# Altium schematic sheet CAN.SchDoc
size A4; SheetNumber: 3; SheetTotal: 7
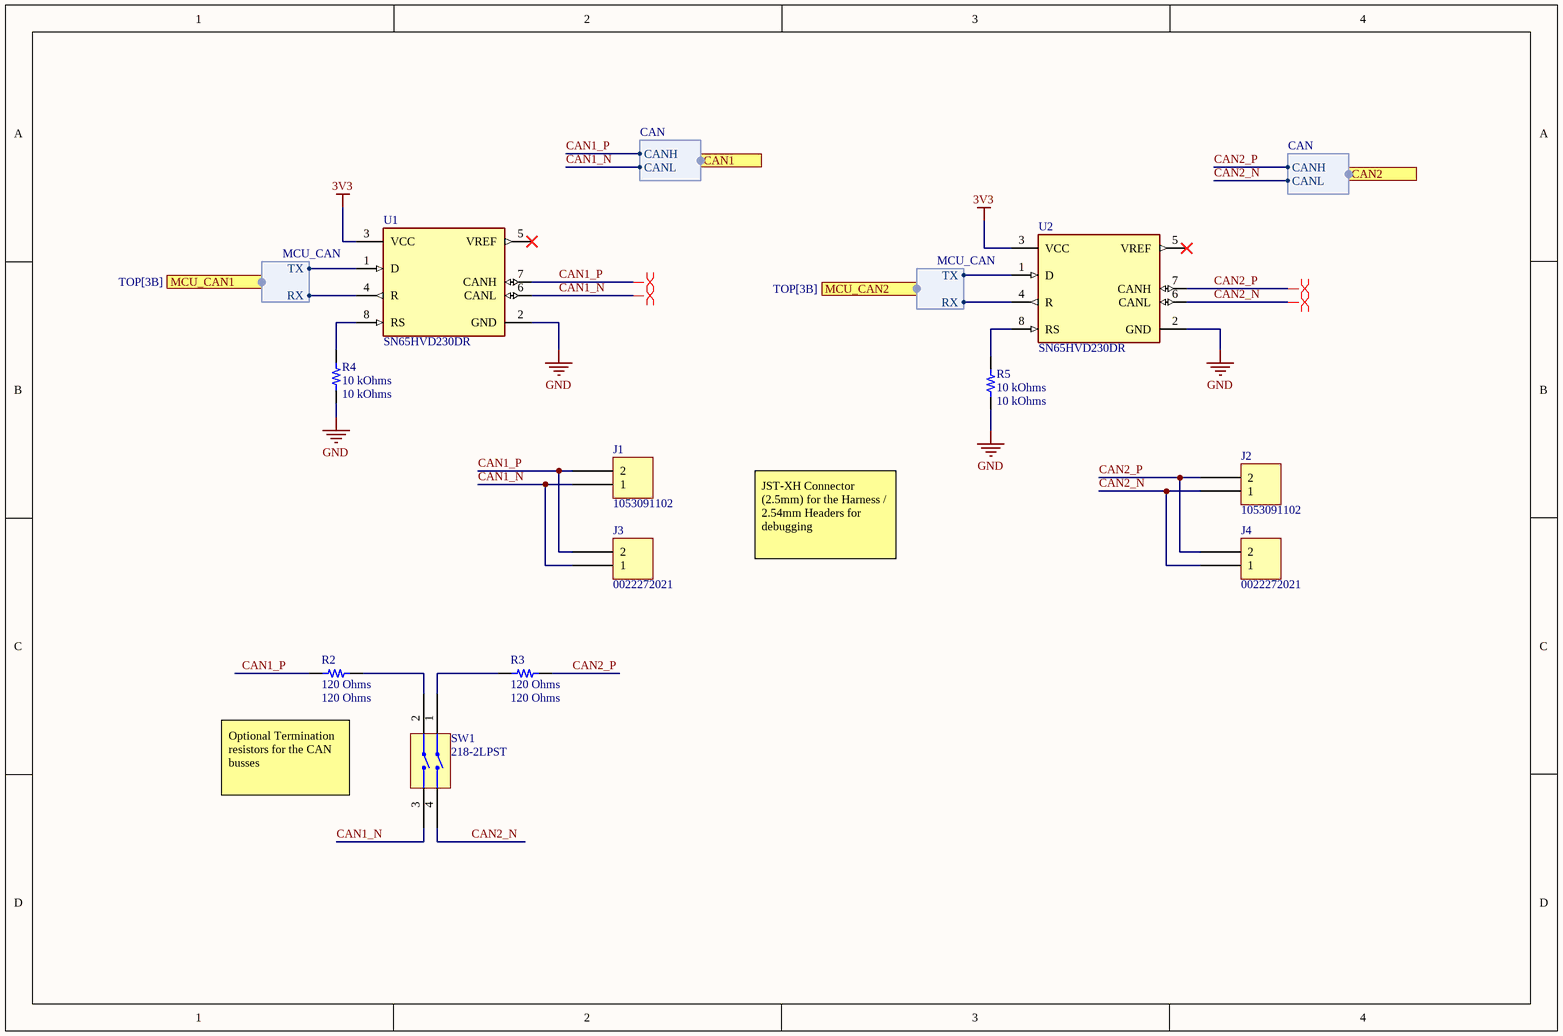
[diagram p0: CAN.SchDoc]

## Parts
J1  1053091102  [MOLEX 1053091102]
J2  1053091102  [MOLEX 1053091102]
J3  0022272021  [MOLEX KK 0022272021]
J4  0022272021  [MOLEX KK 0022272021]
R2  120 Ohms  [RES 0603_1608]
R3  120 Ohms  [RES 0603_1608]
R4  10 kOhms  [RES 0603_1608]
R5  10 kOhms  [RES 0603_1608]
SW1  218-2LPST  [CTS 218-2LPJ]
U1  SN65HVD230DR  [FP-D0008A-IPC_A]
U2  SN65HVD230DR  [FP-D0008A-IPC_A]

## Ports
CAN1 (harness CAN), CAN2 (harness CAN), MCU_CAN1 (harness MCU_CAN, see TOP[3B]), MCU_CAN2 (harness MCU_CAN, see TOP[3B])

## Harnesses
MCU_CAN: RX, TX
CAN: CANH, CANL

## Nets
3V3: U1.3(VCC) U2.3(VCC)
GND: R4.1 R5.1 U1.2(GND) U2.2(GND)
CAN1_N: J1.1 J3.1 SW1.3(GND) U1.6(CANL) ; port CAN1.CANL
CAN1_P: J1.2 J3.2 R2.1 U1.7(CANH) ; port CAN1.CANH
CAN2_N: J2.1 J4.1 SW1.4(GND) U2.6(CANL) ; port CAN2.CANL
CAN2_P: J2.2 J4.2 R3.2 U2.7(CANH) ; port CAN2.CANH
NetR2_2: R2.2 SW1.2(GND)
NetR3_1: R3.1 SW1.1(GND)
NetR4_2: R4.2 U1.8(RS)
NetR5_2: R5.2 U2.8(RS)
NetU1_1: U1.1(D) ; port MCU_CAN1.TX
NetU1_4: U1.4(R) ; port MCU_CAN1.RX
NetU2_1: U2.1(D) ; port MCU_CAN2.TX
NetU2_4: U2.4(R) ; port MCU_CAN2.RX

Not connected (* = marked no-connect by the designer): U1 5(VREF)*; U2 5(VREF)*

## Layout directives
differential pair: CAN1_N, CAN1_P, CAN2_N, CAN2_P

## Notes on the sheet
- JST-XH Connector (2.5mm) for the Harness / 2.54mm Headers for debugging
- Optional Termination resistors for the CAN busses

## Library data of the parts
J1 J2 = 1053091102: CONN HEADER VERT 2POS 2.5MM; Part Number: 1053091102
J3 J4 = 0022272021: CONN HEADER VERT 2POS 2.54MM; Part Number: 0022272021
R2 R3 = ERA-3AEB121V: RES SMD 120 OHM 0.1% 1/10W 0603; Part Number: ERA-3AEB121V; Value: 120 Ohms
R4 R5 = AA0603FR-0710KL: RES SMD 10K OHM 1% 1/10W 0603; Part Number: AA0603FR-0710KL; Value: 10 kOhms
SW1 = 218-2LPST: SWITCH SLIDE DIP SPST 25MA 24V; Part Number: 218-2LPST
U1 U2 = CMP-0315-00015-3: IC TRANSCEIVER HALF 1/1 8SOIC; Number of Transceivers: 1; Operating Supply Voltage: 3.3V; Number of I/Os: 2; Max Supply Current: 17mA; Max Supply Voltage: 3.6V; Min Supply Voltage: 3V; Data Rate: 1Mbps; Min Operating Temperature: -40°C; Packaging: Tape and Reel; Lead Free: Lead Free; Number of Transmit Buffers: 1; Max Operating Temperature: 85°C; Number of Receive Buffers: 1; Number of Pins: 8; Package Quantity: 1; Radiation Hardening: No; Case/Package: D; REACH SVHC: No SVHC; Weight: 0.002561oz; Termination: SMD/SMT; Contact Plating: Gold; Nominal Supply Current: 17mA; Number of Receivers: 1; Number of Drivers: 1